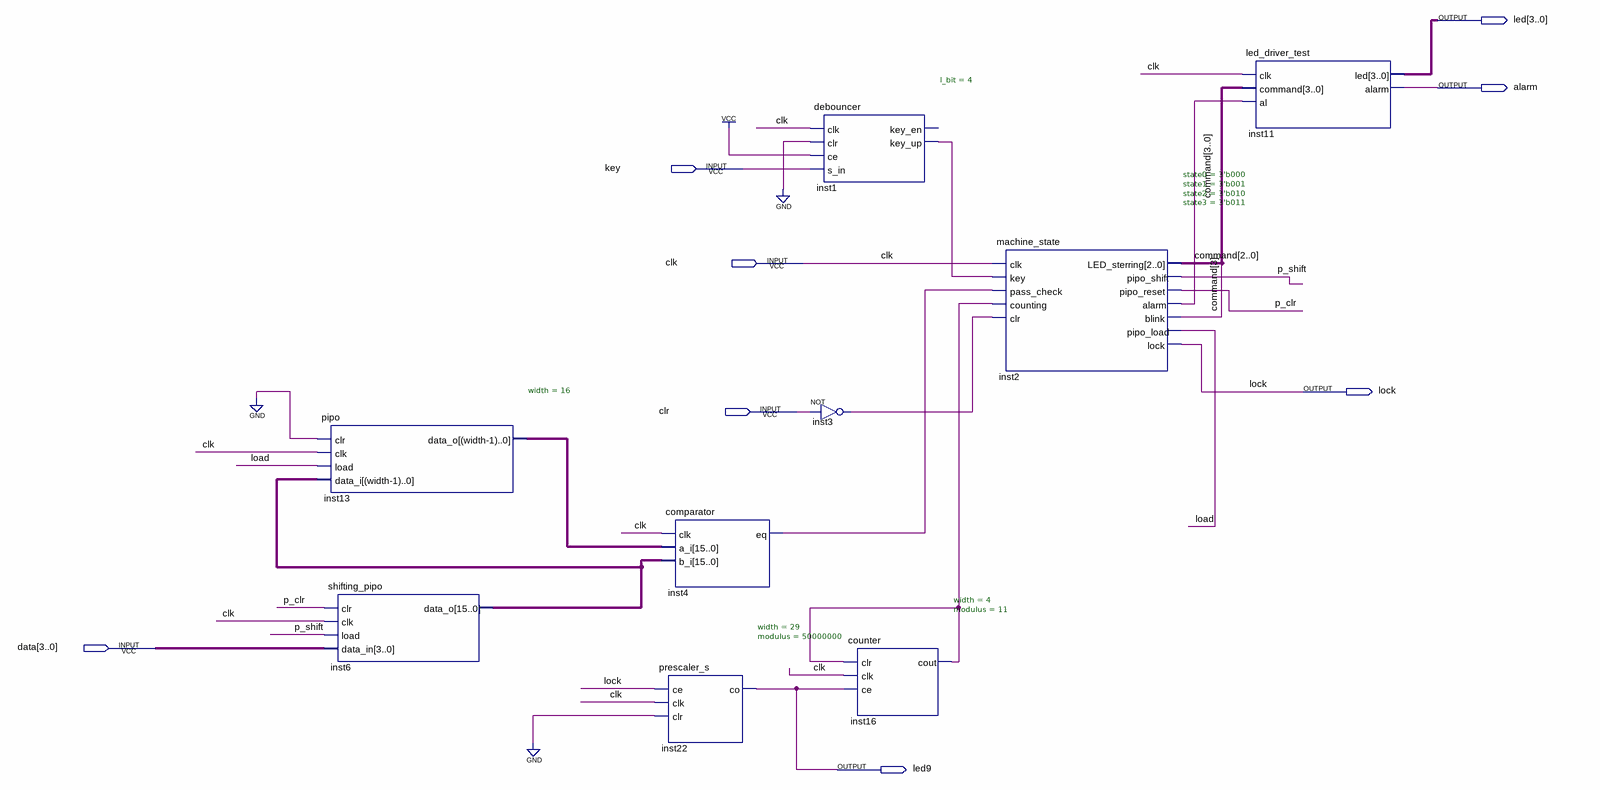
[diagram p0: schematic sheet]
// Quartus schematic zamek.bdf as structural Verilog: 9 symbols, 8 pins
module zamek (
  input  key,
  input  clk,
  input  clr,
  input  [3:0] data,
  output [3:0] led,
  output alarm,
  output lock,
  output led9
);

  wire inst1_key_up, inst2_alarm, inst3_out, inst4_eq, inst16_cout, load, p_clr, p_shift;
  wire [3:0] command;
  wire [15:0] inst6_data_o, inst13_data_o;

  pipo #(.width(16)) inst13 (.clr(1'b0), .clk(clk), .load(load), .data_i(inst6_data_o), .data_o(inst13_data_o));
  shifting_pipo inst6 (.clr(p_clr), .clk(clk), .load(p_shift), .data_in(data), .data_o(inst6_data_o));
  prescaler_s #(.width(29), .modulus(50000000)) inst22 (.ce(lock), .clk(clk), .clr(1'b0), .co(led9));
  comparator inst4 (.clk(clk), .a_i(inst13_data_o), .b_i(inst6_data_o), .eq(inst4_eq));
  debouncer #(.l_bit(4)) inst1 (.clk(clk), .clr(1'b0), .ce(1'b1), .s_in(key), .key_up(inst1_key_up));  // open: key_en
  not inst3 (inst3_out, clr);
  counter #(.width(4), .modulus(11)) inst16 (.clr(inst16_cout), .clk(clk), .ce(led9), .cout(inst16_cout));
  machine_state #(.state0(3'b000), .state1(3'b001), .state2(3'b010), .state3(3'b011)) inst2 (
    .clk(clk), .key(inst1_key_up), .pass_check(inst4_eq), .counting(inst16_cout), .clr(inst3_out),
    .LED_sterring(command[2:0]), .pipo_shift(p_shift), .pipo_reset(p_clr), .alarm(inst2_alarm),
    .blink(command[3]), .pipo_load(load), .lock(lock));
  led_driver_test inst11 (.clk(clk), .command(command), .al(inst2_alarm), .led(led), .alarm(alarm));
endmodule
